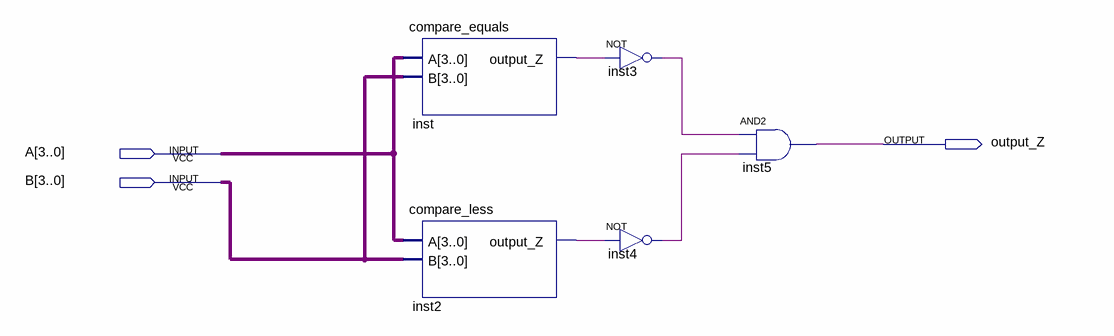
[diagram p0: schematic sheet]
// Quartus schematic compare_greater.bdf as structural Verilog: 5 symbols, 3 pins
module compare_greater (
  input  [3:0] A,
  input  [3:0] B,
  output output_Z
);

  wire inst2_output_z, inst3_out, inst4_out, inst_output_z;

  compare_equals inst (.A(A), .B(B), .output_Z(inst_output_z));
  compare_less inst2 (.A(A), .B(B), .output_Z(inst2_output_z));
  not inst3 (inst3_out, inst_output_z);
  not inst4 (inst4_out, inst2_output_z);
  and inst5 (output_Z, inst3_out, inst4_out);
endmodule
